# Altium schematic sheet TheStaticTurtle_oshw-sdi3g-fiber__schematic_V4-Normal_OSHW_BiDi_SDI_Fiber_Converter_V4_Normal_2024-11-17__SFP.schdoc
size 175 x 141 mm
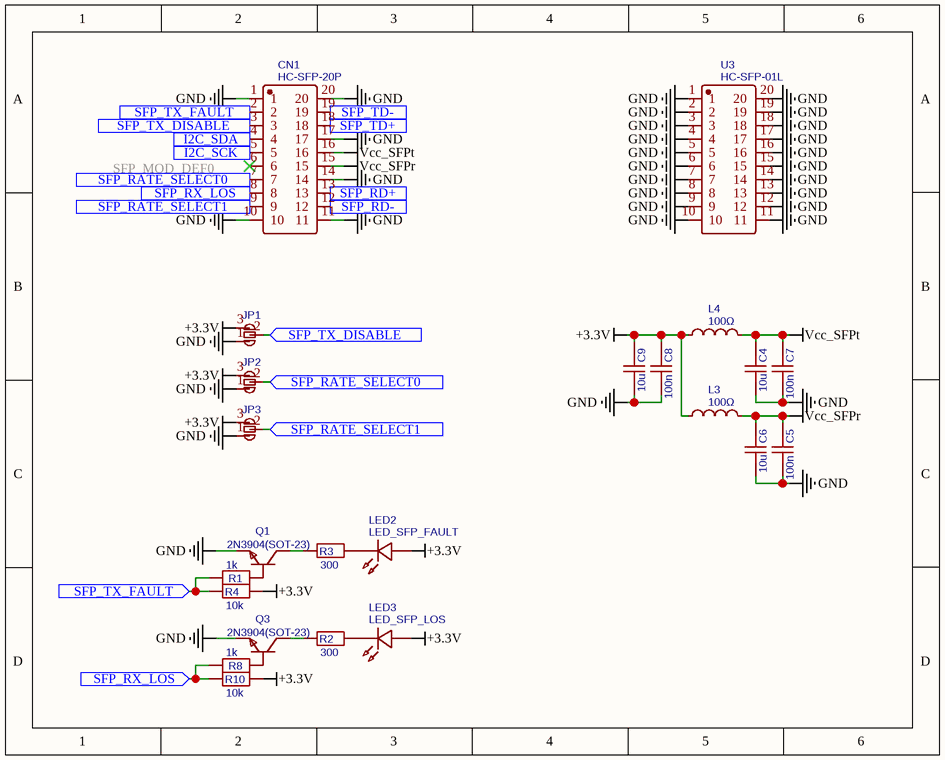
[diagram p0: TheStaticTurtle_oshw-sdi3g-fiber__schematic_V4-Normal_OSHW_BiDi_SDI_Fiber_Converter_V4_Normal_2024-11-17__SFP.schdoc]

## Parts
C4  10u  [C0603]
C5  100n  [C0603]
C6  10u  [C0603]
C7  100n  [C0603]
C8  100n  [C0603]
C9  10u  [C0603]
CN1  HC-SFP-20P  [CONN-SMD_20P-P0.80_HCTL_HC-SFP-20P]
JP1  SOLDER BRIDGE 3P  [SOLDER BRIDGE 3P]  (value not drawn)
JP2  SOLDER BRIDGE 3P  [SOLDER BRIDGE 3P]  (value not drawn)
JP3  SOLDER BRIDGE 3P  [SOLDER BRIDGE 3P]  (value not drawn)
L3  100Ω  [L0805]
L4  100Ω  [L0805]
LED2  LED_SFP_FAULT  [LED0805_RED]
LED3  LED_SFP_LOS  [LED0805_RED]
Q1  2N3904(SOT-23)  [SOT-23-3_L2.9-W1.3-P1.90-LS2.4-TR]
Q3  2N3904(SOT-23)  [SOT-23-3_L2.9-W1.3-P1.90-LS2.4-TR]
R1  1k  [R0603]
R2  300  [R0603]
R3  300  [R0603]
R4  10k  [R0603]
R8  1k  [R0603]
R10  10k  [R0603]
U3  HC-SFP-01L  [TH_HC-SFP-01L]

## Ports
I2C_SCK (in), I2C_SDA (in), SFP_RATE_SELECT0 (in), SFP_RATE_SELECT1 (in), SFP_RD+ (in), SFP_RD- (in), SFP_RX_LOS (in), SFP_TD+ (in), SFP_TD- (in), SFP_TX_DISABLE (in), SFP_TX_FAULT (in)

## Nets
+3.3V: C8.2 C9.2 JP1.3(B) JP2.3(B) JP3.3(B) L3.1 L4.1 LED2.1 LED3.1 R4.1 R10.1
GND: C4.1 C5.1 C6.1 C7.1 C8.1 C9.1 CN1.1 CN1.10 CN1.11 CN1.14 CN1.17 CN1.20 JP1.1(A) JP2.1(A) JP3.1(A) Q1.1(E) Q3.1(E) U3.1 U3.2 U3.3 U3.4 U3.5 U3.6 U3.7 U3.8 U3.9 U3.10 U3.11 U3.12 U3.13 U3.14 U3.15 U3.16 U3.17 U3.18 U3.19 U3.20
Vcc_SFPr: C5.2 C6.2 CN1.15 L3.2
Vcc_SFPt: C4.2 C7.2 CN1.16 L4.2
I2C_SCK: CN1.5 ; port I2C_SCK
I2C_SDA: CN1.4 ; port I2C_SDA
SFP_RATE_SELECT0: CN1.7 JP2.2(B) ; port SFP_RATE_SELECT0
SFP_RATE_SELECT1: CN1.9 JP3.2(B) ; port SFP_RATE_SELECT1
SFP_RD+: CN1.13 ; port SFP_RD+
SFP_RD-: CN1.12 ; port SFP_RD-
SFP_RX_LOS: CN1.8 R8.2 R10.2 ; port SFP_RX_LOS
SFP_TD+: CN1.18 ; port SFP_TD+
SFP_TD-: CN1.19 ; port SFP_TD-
SFP_TX_DISABLE: CN1.3 JP1.2(B) ; port SFP_TX_DISABLE
SFP_TX_FAULT: CN1.2 R1.2 R4.2 ; port SFP_TX_FAULT
NetLED2_2: LED2.2 R3.1
NetLED3_2: LED3.2 R2.1
NetQ1_2: Q1.2(B) R1.1
NetQ1_3: Q1.3(C) R3.2
NetQ3_2: Q3.2(B) R8.1
NetQ3_3: Q3.3(C) R2.2

Not connected (* = marked no-connect by the designer): CN1 6*

## Notes on the sheet
- (near CN1) SFP_MOD_DEF0

## Library data of the parts
C4 C6 C9 = 10u: nameAlias: Value(F); Contributor: LCEDA_Lib; spicePre: C; spiceSymbolName: C_0603_US
C5 C7 C8 = 100n: nameAlias: Value(F); Contributor: LCEDA_Lib; spicePre: C; spiceSymbolName: C_0603_US
CN1 = HC-SFP-20P: Manufacturer: HCTL(华灿天禄); Contributor: LCSC; Supplier: LCSC; Supplier Part: C2897291; Manufacturer Part: HC-SFP-20P; JLCPCB Part Class: Extended Part; spicePre: C; spiceSymbolName: HC-SFP-20P
JP1-JP3 = SOLDER BRIDGE 3P: Contributor: TheStaticTurtle; spicePre: U; spiceSymbolName: SOLDER BRIDGE 3P
L3 L4 = 100Ω: Manufacturer: Sunlord(顺络); Manufacturer Part: GZ2012D101TF; nameAlias: Value; Supplier: LCSC; Supplier Part: C1015; JLCPCB Part Class: Basic Part; spicePre: L; spiceSymbolName: GZ2012D101TF
LED2 = LED_SFP_FAULT: Manufacturer: EVERLIGHT(台湾亿光); Manufacturer Part: 17-21SURC/S530-A3/TR8; Contributor: LCEDA_Lib; Supplier Part: C72037; spicePre: L; spiceSymbolName: LED-0805_R
LED3 = LED_SFP_LOS: Manufacturer: EVERLIGHT(台湾亿光); Manufacturer Part: 17-21SURC/S530-A3/TR8; Contributor: LCEDA_Lib; Supplier Part: C72037; spicePre: L; spiceSymbolName: LED-0805_R
Q1 Q3 = 2N3904(SOT-23): Manufacturer: KEC; Manufacturer Part: 2n3904S-RTK/PS; Contributor: LCEDA_Lib; Supplier: LCSC; Supplier Part: C18536; Paste Type: SOT-23; spicePre: Q; spiceSymbolName: 2N3904(SOT-23)
R1 R8 = 1k: nameAlias: Value(Ω); Contributor: LCEDA_Lib; spicePre: R; spiceSymbolName: R_0603_EU
R2 R3 = 300: nameAlias: Value(Ω); Contributor: LCEDA_Lib; spicePre: R; spiceSymbolName: R_0603_EU
R4 R10 = 10k: nameAlias: Value(Ω); Contributor: LCEDA_Lib; spicePre: R; spiceSymbolName: R_0603_EU
U3 = HC-SFP-01L: Manufacturer: HCTL(华灿天禄); Contributor: LCSC; Supplier: LCSC; Supplier Part: C2897292; Manufacturer Part: HC-SFP-01L; JLCPCB Part Class: Extended Part; spicePre: U; spiceSymbolName: HC-SFP-01L